# EAGLE design M960old (EAGLE 6.6.0)
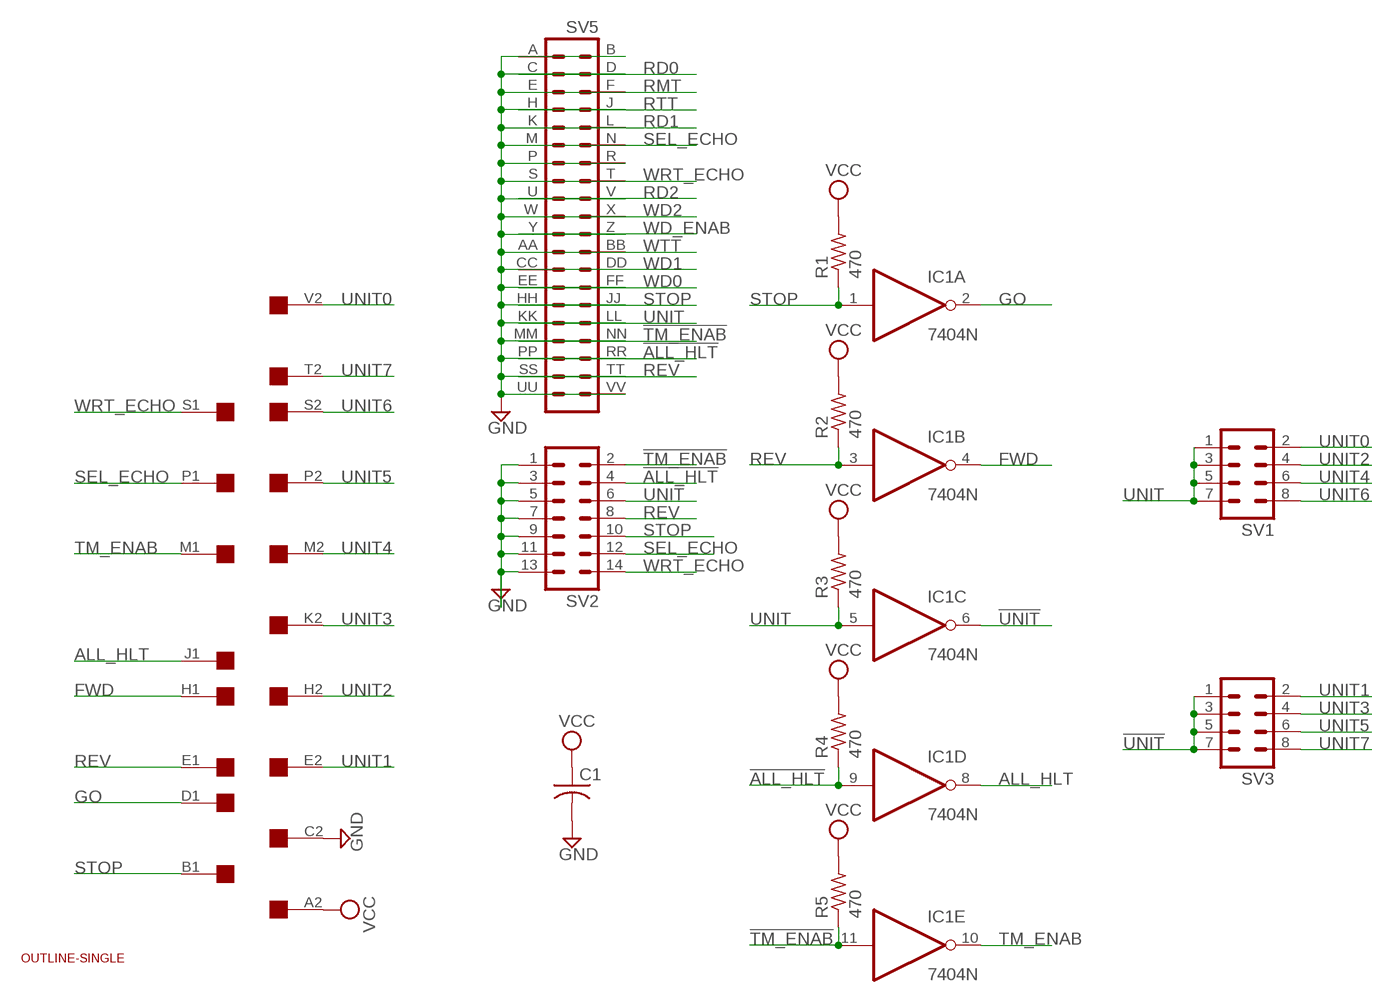
[diagram p0: schematic, sheet 1]

## Parts
C1  C-US050-025X075  [C050-025X075]
IC1  7404N  [DIL14]
R1  470  R-US_0207/10  [0207/10]
R2  470  R-US_0207/10  [0207/10]
R3  470  R-US_0207/10  [0207/10]
R4  470  R-US_0207/10  [0207/10]
R5  470  R-US_0207/10  [0207/10]
SV1  MA04-2  [MA04-2]
SV2  MA07-2  [MA07-2]
SV3  MA04-2  [MA04-2]
SV5  DEC40PINV  [DEC40PINV]
U$1  OUTLINE-SINGLE  [SINGLE]
U$2  SINGLE  [EDGE-CON2]

## Nets
!ALL_HLT: IC1.9(D:I) R4.1 SV2.4 SV5.PP
!TM_ENAB: IC1.11(E:I) R5.1 SV2.2 SV5.MM
!UNIT: IC1.6(C:O) SV3.1 SV3.3 SV3.5 SV3.7
ALL_HLT: IC1.8(D:O) U$2.J1
FWD: IC1.4(B:O) U$2.H1
GND: C1.2 SV2.1 SV2.3 SV2.5 SV2.7 SV2.9 SV2.11 SV2.13 SV5.B SV5.BB SV5.D SV5.DD SV5.F SV5.FF SV5.J SV5.JJ SV5.L SV5.LL SV5.N SV5.NN SV5.R SV5.RR SV5.T SV5.TT SV5.V SV5.VV SV5.X SV5.Z U$2.C2
GO: IC1.2(A:O) U$2.D1
RD0: SV5.C
RD1: SV5.K
RD2: SV5.U
REV: IC1.3(B:I) R2.1 SV2.8 SV5.SS U$2.E1
RMT: SV5.E
RTT: SV5.H
SEL_ECHO: SV2.12 SV5.M U$2.P1
STOP: IC1.1(A:I) R1.1 SV2.10 SV5.HH U$2.B1
TM_ENAB: IC1.10(E:O) U$2.M1
UNIT: IC1.5(C:I) R3.1 SV1.1 SV1.3 SV1.5 SV1.7 SV2.6 SV5.KK
UNIT0: SV1.2 U$2.V2
UNIT1: SV3.2 U$2.E2
UNIT2: SV1.4 U$2.H2
UNIT3: SV3.4 U$2.K2
UNIT4: SV1.6 U$2.M2
UNIT5: SV3.6 U$2.P2
UNIT6: SV1.8 U$2.S2
UNIT7: SV3.8 U$2.T2
VCC: C1.1 R1.2 R2.2 R3.2 R4.2 R5.2 U$2.A2
WD0: SV5.EE
WD1: SV5.CC
WD2: SV5.W
WD_ENAB: SV5.Y
WRT_ECHO: SV2.14 SV5.S U$2.S1
WTT: SV5.AA
Unconnected: IC1.12(F:O) IC1.13(F:I) SV5.A SV5.P SV5.UU U$2.A1 U$2.B2 U$2.C1 U$2.D2 U$2.F1 U$2.F2 U$2.J2 U$2.K1 U$2.L1 U$2.L2 U$2.N1 U$2.N2 U$2.R1 U$2.R2 U$2.T1 U$2.U1 U$2.U2 U$2.V1

## Power pins joined to a net without a drawn wire
GND: IC1.7(P:GND)
VCC: IC1.14(P:VCC)

## Library data of the parts
C1 = rcl:C-US: CAPACITOR, American symbol
IC1 = 74xx-us:74*04: Hex INVERTER
R1-R5 = rcl:R-US_: RESISTOR, American symbol
SV1 SV3 = con-lstb:MA04-2: PIN HEADER; OC_FARNELL: unknown; OC_NEWARK: unknown
SV2 = con-lstb:MA07-2: PIN HEADER; OC_FARNELL: unknown; OC_NEWARK: unknown
SV5 = dec-con:DEC40PIN: PIN HEADER
U$1 = dec-con:OUTLINE-*: Board outlines for DEC boards.
U$2 = dec-con:SINGLE: Single-Height DEC board

## Board
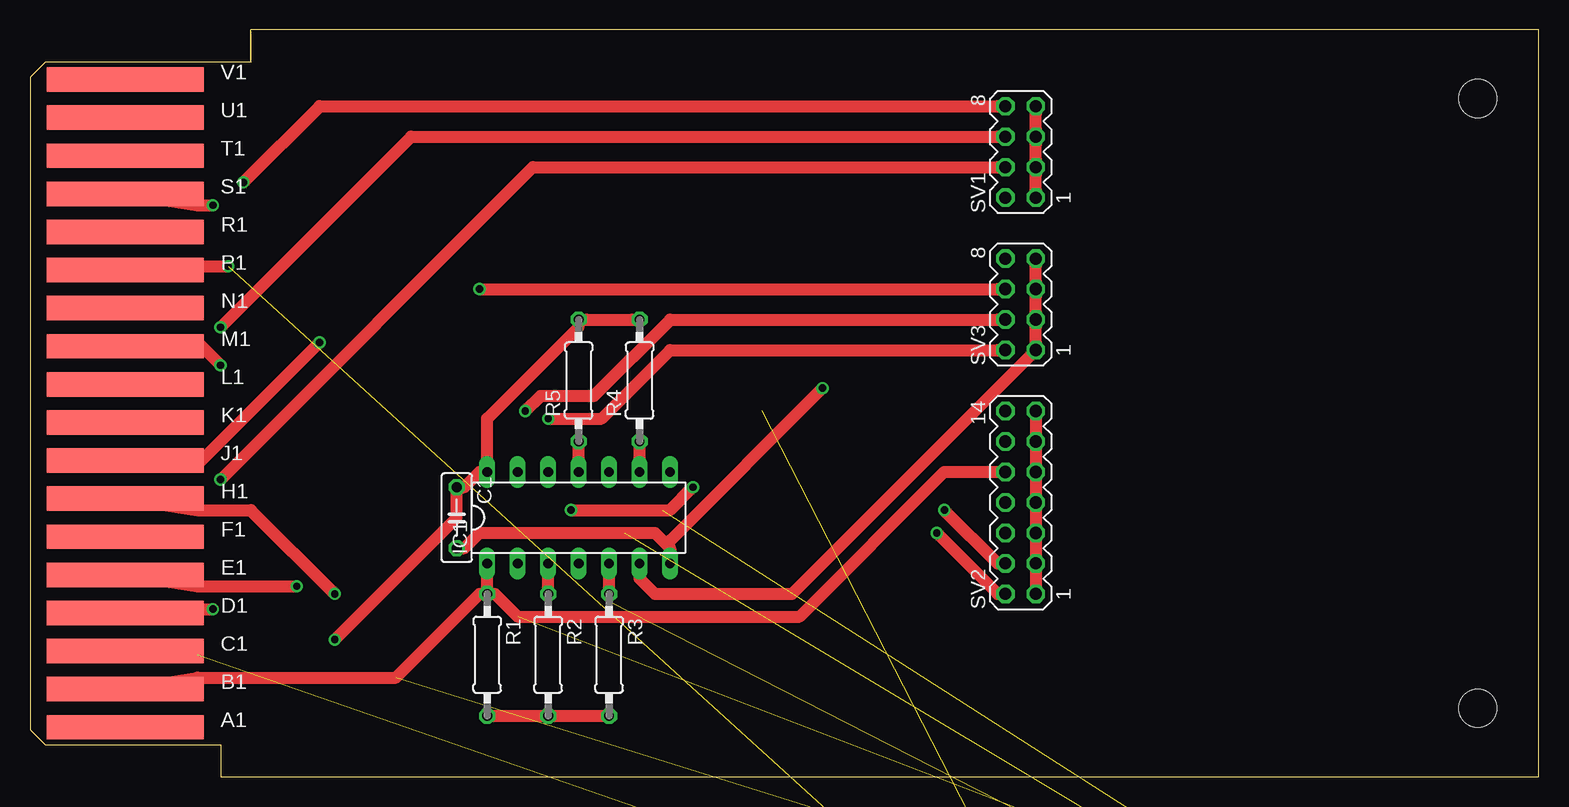
[diagram p1: board, top side]
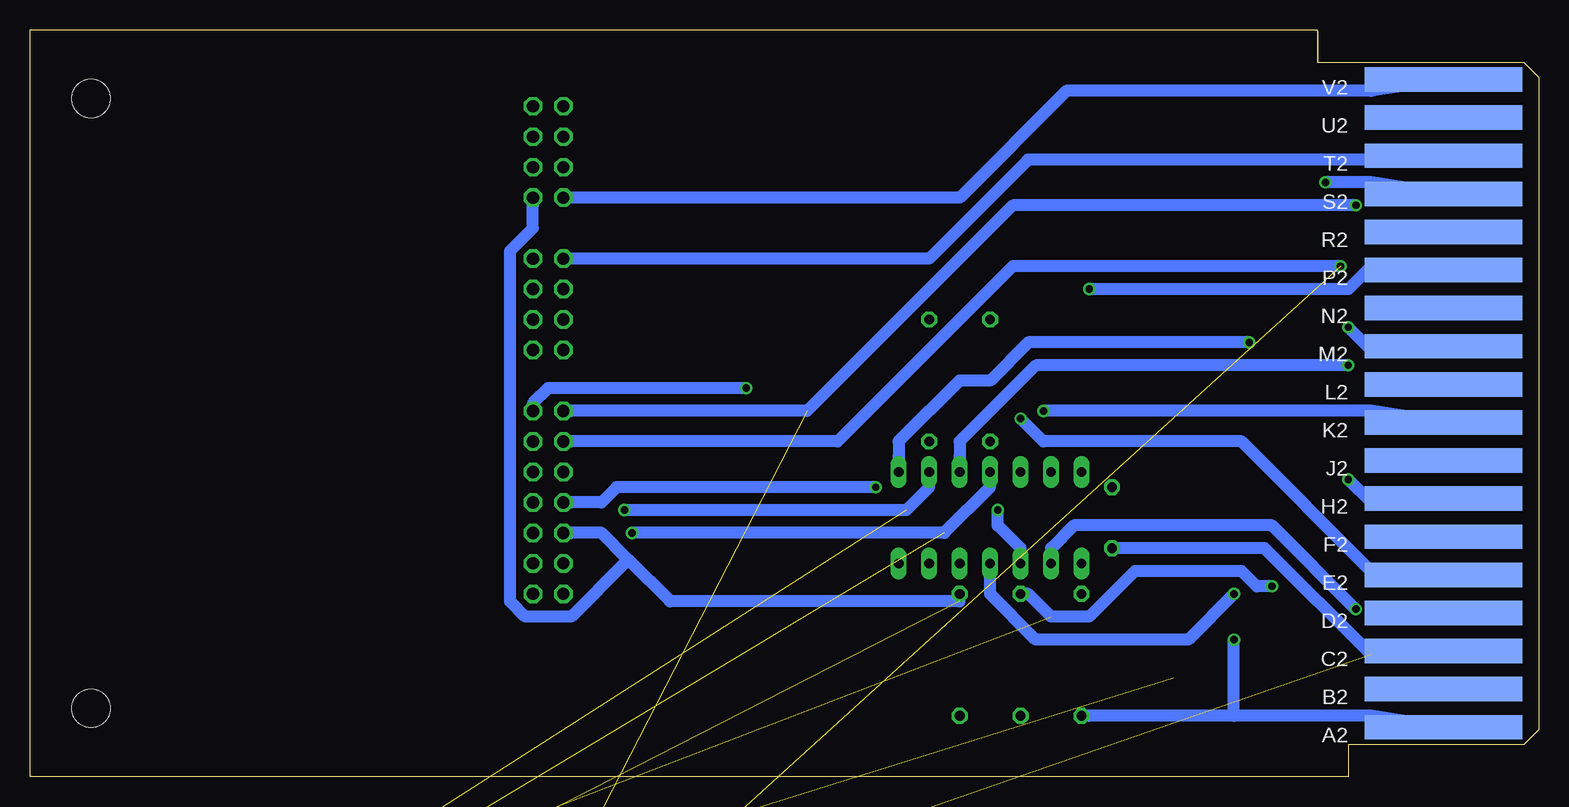
[diagram p2: board, bottom side, seen from below]

Size 125.73 x 62.23 mm. Coordinates in mm from the lower left corner, seen from the top.
Copper layers (1*16): Top 0.035mm / dielectric 1.5mm / Bottom 0.035mm
Design rules "15mils": minimum track width 40mil, minimum drill 24mil, track to track 20mil, track to pad 10mil, pad to pad 10mil, via to via 10mil, smd to smd 10mil, copper to edge 25mil, drill to drill 10mil, minimum pad ring 10mil, minimum via ring 8mil, stop-mask expansion 0mil, vias tented up to drill 0mil, thermal gap 10mil

### Footprints (pad centres in the part's own frame; a part is rotated, then mirrored left to right if it is on the bottom)
C050-025X075 = drill 0.813 octagon: 1 -2.54,0; 2 2.54,0
DIL14 = drill 0.813 long: 1 -7.62,-3.81; 2 -5.08,-3.81; 3 -2.54,-3.81; 4 0,-3.81; 5 2.54,-3.81; 6 5.08,-3.81; 7 7.62,-3.81; 8 7.62,3.81; 9 5.08,3.81; 10 2.54,3.81; 11 0,3.81; 12 -2.54,3.81; 13 -5.08,3.81; 14 -7.62,3.81
0207/10 = drill 0.813 octagon: 1 -5.08,0; 2 5.08,0
MA04-2 = drill 1.016 octagon: 1 -3.81,-1.27; 2 -3.81,1.27; 3 -1.27,-1.27; 4 -1.27,1.27; 5 1.27,-1.27; 6 1.27,1.27; 7 3.81,-1.27; 8 3.81,1.27
MA07-2 = drill 1.016 octagon: 1 -7.62,-1.27; 2 -7.62,1.27; 3 -5.08,-1.27; 4 -5.08,1.27; 5 -2.54,-1.27; 6 -2.54,1.27; 7 0,-1.27; 8 0,1.27; 9 2.54,-1.27; 10 2.54,1.27; 11 5.08,-1.27; 12 5.08,1.27; 13 7.62,-1.27; 14 7.62,1.27
DEC40PINV = drill 1.016 octagon: A -24.13,-1.27; AA 3.81,-1.27; B -24.13,1.27; BB 3.81,1.27; C -21.59,-1.27; CC 6.35,-1.27; D -21.59,1.27; DD 6.35,1.27; E -19.05,-1.27; EE 8.89,-1.27; F -19.05,1.27; FF 8.89,1.27; H -16.51,-1.27; HH 11.43,-1.27; J -16.51,1.27; JJ 11.43,1.27; K -13.97,-1.27; KK 13.97,-1.27; L -13.97,1.27; LL 13.97,1.27; M -11.43,-1.27; MM 16.51,-1.27; N -11.43,1.27; NN 16.51,1.27; P -8.89,-1.27; PP 19.05,-1.27; R -8.89,1.27; RR 19.05,1.27; S -6.35,-1.27; SS 21.59,-1.27; T -6.35,1.27; TT 21.59,1.27; U -3.81,-1.27; UU 24.13,-1.27; V -3.81,1.27; VV 24.13,1.27; W -1.27,-1.27; X -1.27,1.27; Y 1.27,-1.27; Z 1.27,1.27
SINGLE = hole 3.175: 120.65,56.515; 120.65,5.715
EDGE-CON2 = smd 13.106 x 2.032: A1 7.938,4.128; B1 7.938,7.303; C1 7.938,10.477; D1 7.938,13.652; E1 7.938,16.828; F1 7.938,20.003; H1 7.938,23.177; J1 7.938,26.352; K1 7.938,29.527; L1 7.938,32.703; M1 7.938,35.877; N1 7.938,39.053; P1 7.938,42.227; R1 7.938,45.403; S1 7.938,48.578; T1 7.938,51.752; U1 7.938,54.928; V1 7.938,58.102 | smd 13.106 x 2.032 bottom: A2 7.938,4.128; B2 7.938,7.303; C2 7.938,10.477; D2 7.938,13.652; E2 7.938,16.828; F2 7.938,20.003; H2 7.938,23.177; J2 7.938,26.352; K2 7.938,29.527; L2 7.938,32.703; M2 7.938,35.877; N2 7.938,39.053; P2 7.938,42.227; R2 7.938,45.403; S2 7.938,48.578; T2 7.938,51.752; U2 7.938,54.928; V2 7.938,58.102

### Placement (x,y rotation side)
C1  35.56,21.59 270 top
IC1  45.72,21.59 0 top
R1  38.1,10.16 270 top
R2  43.18,10.16 270 top
R3  48.26,10.16 270 top
R4  50.8,33.02 90 top
R5  45.72,33.02 90 top
SV1  82.55,52.07 90 top
SV2  82.55,22.86 90 top
SV3  82.55,39.37 90 top
SV5  90.17,-12.7 0 top  (outside the outline)
U$1  0,0 0 top
U$2  0,0 0 top

### Tracks (layer width: path | path; a pad name or v marks a point on that pad's centre or on a via)
!ALL_HLT  (via drill 0.61)  (1 unrouted)
  Top 1.016: IC1.9 50.8,26.67 50.8,27.3 R4.1 | v76.2,22.23 80.65,17.78 SV2.4
  Bottom 1.016: v76.2,22.23 52.71,22.23 50.8,24.13 IC1.9
!TM_ENAB  (via drill 0.61)  (1 unrouted)
  Top 1.016: IC1.11 45.72,26.67 45.72,27.3 R5.1 | v75.57,20.32 80.65,15.24 SV2.2
  Bottom 1.016: v75.57,20.32 49.53,20.32 45.72,24.13 IC1.11
!UNIT
  Top 1.016: IC1.6 50.8,16.51 52.07,15.24 63.5,15.24 SV3.1 83.82,36.2 83.82,37.47 SV3.3 83.82,38.73 83.82,40.01 SV3.5 83.82,41.27 83.82,42.55 SV3.7
ALL_HLT  (via drill 0.61)
  Top 1.016: v24.13,36.2 13.97,26.04 U$2.J1
  Bottom 1.016: v24.13,36.2 42.55,36.2 45.72,33.02 48.26,33.02 53.34,27.94 53.34,26.67 IC1.8
FWD  (via drill 0.61)
  Top 1.016: v25.4,15.24 18.42,22.23 13.97,22.23 U$2.H1
  Bottom 1.016: v25.4,15.24 29.21,11.43 41.91,11.43 45.72,15.24 45.72,16.51 IC1.4
GND  (via drill 0.61)  (20 unrouted)
  Top 1.016: SV2.1 83.82,15.88 83.82,17.14 SV2.3 83.82,18.41 83.82,19.68 SV2.5 83.82,20.95 83.82,22.23 SV2.7 83.82,23.5 83.82,24.77 SV2.9 83.82,26.04 83.82,27.3 SV2.11 83.82,28.57 83.82,29.84 SV2.13 | 53.02,19.37 52.07,20.32 37.47,20.32 36.2,19.05 C1.2 | 53.02,19.37 53.34,19.05 IC1.7 | v66.04,32.38 53.34,19.68 53.02,19.37
  Bottom 1.016: C1.2 34.93,19.05 22.86,19.05 13.97,10.16 U$2.C2 | v66.04,32.38 82.55,32.38 83.82,31.11 SV2.13
GO  (via drill 0.61)
  Top 1.016: v15.24,13.97 13.97,13.97 U$2.D1
  Bottom 1.016: v15.24,13.97 22.23,20.95 38.74,20.95 40.64,19.05 IC1.2
REV  (via drill 0.61)  (1 unrouted)
  Top 1.016: R2.1 43.18,15.88 43.18,16.51 IC1.3 | v55.25,24.13 53.34,22.23 v45.09,22.23 | v22.23,15.88 13.97,15.88 U$2.E1
  Bottom 1.016: v55.25,24.13 76.84,24.13 78.11,22.86 80.65,22.86 SV2.8 | v45.09,22.23 45.09,20.95 43.18,19.05 IC1.3 | v22.23,15.88 23.5,15.88 24.77,17.14 33.66,17.14 37.47,13.34 40.64,13.34 42.55,15.24 R2.1
SEL_ECHO  (via drill 0.61)  (1 unrouted)
  Top 1.016: v16.51,42.55 13.97,42.55 U$2.P1
  Bottom 1.016: v16.51,42.55 43.82,42.55 58.42,27.94 80.65,27.94 SV2.12
STOP  (1 unrouted)
  Top 1.016: R1.1 38.1,15.88 38.1,16.51 IC1.1 | SV2.10 80.65,25.4 76.2,25.4 64.14,13.34 40.64,13.34 38.74,15.24 R1.1 | U$2.B1 13.97,8.26 30.48,8.26 37.47,15.24 R1.1
TM_ENAB  (via drill 0.61)
  Top 1.016: v15.88,34.29 13.97,36.2 U$2.M1
  Bottom 1.016: v15.88,34.29 41.91,34.29 48.26,27.94 48.26,26.67 IC1.10
UNIT  (1 unrouted)
  Top 1.016: SV1.1 83.82,48.9 83.82,50.16 SV1.3 83.82,51.44 83.82,52.7 SV1.5 83.82,53.98 83.82,55.24 SV1.7 | R3.1 48.26,15.88 48.26,16.51 IC1.5
  Bottom 1.016: 75.88,18.1 72.39,14.61 48.26,14.61 R3.1 | 75.88,18.1 78.11,20.32 80.65,20.32 SV2.6 | SV1.1 83.82,47.62 83.82,45.72 85.73,43.81 85.73,14.61 84.46,13.34 80.65,13.34 76.2,17.78 75.88,18.1
UNIT0
  Bottom 1.016: SV1.2 80.65,48.26 48.26,48.26 39.37,57.15 13.97,57.15 U$2.V2
UNIT1  (via drill 0.61)
  Top 1.016: v43.18,29.84 47.63,29.84 53.34,35.56 80.65,35.56 SV3.2
  Bottom 1.016: v43.18,29.84 41.28,27.94 24.77,27.94 13.97,17.14 U$2.E2
UNIT2  (via drill 0.61)
  Top 1.016: v15.88,24.77 41.91,50.8 80.65,50.8 SV1.4
  Bottom 1.016: v15.88,24.77 13.97,22.86 U$2.H2
UNIT3  (via drill 0.61)
  Top 1.016: v41.28,30.48 42.55,31.75 46.99,31.75 53.34,38.1 80.65,38.1 SV3.4
  Bottom 1.016: v41.28,30.48 13.97,30.48 U$2.K2
UNIT4  (via drill 0.61)
  Top 1.016: v15.88,37.47 31.75,53.34 80.65,53.34 SV1.6
  Bottom 1.016: v15.88,37.47 13.97,35.56 U$2.M2
UNIT5  (via drill 0.61)
  Top 1.016: v37.47,40.64 80.65,40.64 SV3.6
  Bottom 1.016: v37.47,40.64 15.88,40.64 13.97,42.55 U$2.P2
UNIT6  (via drill 0.61)
  Top 1.016: v17.78,49.53 24.13,55.88 80.65,55.88 SV1.8
  Bottom 1.016: v17.78,49.53 13.97,49.53 U$2.S2
UNIT7
  Bottom 1.016: SV3.8 80.65,43.18 50.8,43.18 42.55,51.44 13.97,51.44 U$2.T2
VCC  (via drill 0.61)
  Top 1.016: R4.2 50.17,38.1 46.36,38.1 R5.2 45.72,37.47 38.1,29.84 38.1,26.67 IC1.14 37.47,25.4 36.2,24.13 C1.1 35.56,23.5 35.56,21.59 v25.4,11.43 | R1.2 38.74,5.08 42.55,5.08 R2.2 43.82,5.08 47.63,5.08 R3.2
  Bottom 1.016: 25.4,5.08 13.97,5.08 U$2.A2 | 25.4,5.08 37.47,5.08 R1.2 | 25.4,5.08 v25.4,11.43
WRT_ECHO  (via drill 0.61)  (1 unrouted)
  Top 1.016: v15.24,47.62 13.97,47.62 U$2.S1
  Bottom 1.016: v15.24,47.62 43.82,47.62 60.96,30.48 80.65,30.48 SV2.14

### Text on the board
tValues: Unit7 | Unit5 | Unit3 | Unit1 | Unit6 | Unit4 | Unit2 | Unit0